# Altium schematic sheet régulateur.SchDoc
size A4; SheetNumber: 3; SheetTotal: 4
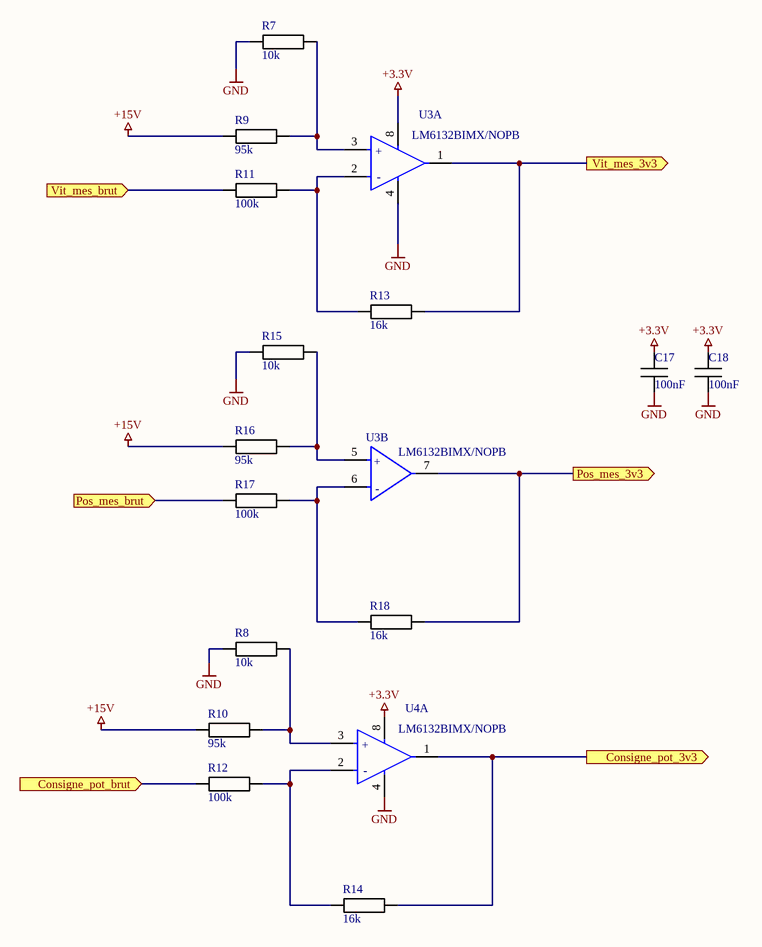
[diagram p0: régulateur.SchDoc]

## Parts
C17  100nF  [CAPC1608X08M]
C18  100nF  [CAPC1608X08M]
R7  10k  [RESC2012X06M]
R8  10k  [RESC2012X06M]
R9  95k  [RESC2012X06M]
R10  95k  [RESC2012X06M]
R11  100k  [RESC2012X06M]
R12  100k  [RESC2012X06M]
R13  16k  [RESC2012X06M]
R14  16k  [RESC2012X06M]
R15  10k  [RESC2012X06M]
R16  95k  [RESC2012X06M]
R17  100k  [RESC2012X06M]
R18  16k  [RESC2012X06M]
U3  LM6132BIMX/NOPB  [FP-LM6132BIMX-NOPB-MFG]  (parts A,B of 2)
U4  LM6132BIMX/NOPB  [FP-LM6132BIMX-NOPB-MFG]  (part A of 2)

## Ports
Consigne_pot_3v3 (out), Consigne_pot_brut (in), Pos_mes_3v3 (out), Pos_mes_brut (in), Vit_mes_3v3 (out), Vit_mes_brut (in)

## Nets
+3.3V: C17.2 C18.2 U3.8(V+) U4.8(V+)
+15V: R9.1 R10.1 R16.1
GND: C17.1 C18.1 R7.1 R8.1 R15.1 U3.4(V-) U4.4(V-)
Consigne_pot_3v3: R14.1 U4.1(OUT_A) ; port Consigne_pot_3v3
Consigne_pot_brut: R12.1 ; port Consigne_pot_brut
Pos_mes_3v3: R18.1 U3.7(OUT_B) ; port Pos_mes_3v3
Pos_mes_brut: R17.1 ; port Pos_mes_brut
Vit_mes_3v3: R13.1 U3.1(OUT_A) ; port Vit_mes_3v3
Vit_mes_brut: R11.1 ; port Vit_mes_brut
NetR7_2: R7.2 R9.2 U3.3(+IN_A)
NetR8_2: R8.2 R10.2 U4.3(+IN_A)
NetR11_2: R11.2 R13.2 U3.2(-IN_A)
NetR12_2: R12.2 R14.2 U4.2(-IN_A)
NetR15_2: R15.2 R16.2 U3.5(+IN_B)
NetR17_2: R17.2 R18.2 U3.6(-IN_B)

## Notes on the sheet
- (in symbol CMP-04895-000003-1, part A) +; -
- (in symbol CMP-04895-000003-1, part B) +; -

## Library data of the parts
C17 C18 = CMP-065-000000-2: CAPC 100nF X7R 50V 10% 1608 (0603 INCH); Manufacturer: TDK; Manufacturer Number: CGA3E2X7R1H104K080AA; IsStocked: 1; PN: PN-338083; Current: NULL; TemperatureRange: -55°C to +125°C; Voltage: 50V; Dielectric: X7R; Value: 100nF; Category: Passives; Supplier Price 1: 0.0100; Supplier Part Number 1: FAB.0603_C 100n; SubCategory: Condensateurs ceramique; Tolerance: ±10%; Supplier 1: ETML; TemperatureCoeff: NULL; Power: NULL
R7-R18 = CMP-066-000209-2: RES 68kohm  ±1% 0.125W 2012 (0805 INCH); Manufacturer Number: RC0805FR-0768KL; Manufacturer: Yageo; TemperatureRange: -55°C to 155°C; PN: PN-665325; Value: 68k; TemperatureCoeff: ±200ppm/°C; Voltage: 150V; IsStocked: 1; Supplier Part Number 1: FAB.0805_R 68k; Category: Passives; Supplier 1: ETML; SubCategory: Resistances couche epaisse; Power: 0.125W; Supplier Price 1: 0.0200; Tolerance: ±1%
U3 U4 = CMP-04895-000003-1: IC OPAMP GP 2 CIRCUIT 8SOIC; Manufacturer: Texas Instruments; Nominal Supply Current: 720uA; Number Of Channels: 2; Voltage Gain: 102V/mV; Input Offset Voltage: 1.7V; Max Dual Supply Voltage: 12V; Gain Bandwidth: 11MHz; Min Supply Voltage: 1.8V; Max Junction Temp: +150°C; Standoff Height: 0.11mm; Output Current Per Channel: 3.5mA; Min Dual Supply Voltage: 0.9V; Max Supply Voltage: 24V; Input Bias Current: 0.125uA; Digikey Description: IC OPAMP GP 2 CIRCUIT 8SOIC; Height: 1.75mm; ComponentLink2URL: http://www.ti.com/lit/ds/symlink/lm6132.pdf; Temperature Range High: +85°C; Device Class L2: Linear ICs; Manufacturer Part Number: LM6132BIMX/NOPB; Lead Free: Yes; ComponentLink2Description: Datasheet; Temperature: -40°C to +85°C; Device Class L1: Integrated Circuits (ICs); Category: IC; Temperature Range Low: -40°C; Automotive: No; RoHS: TRUE; Package: SOIC-8; Octopart: https://octopart.com/lm6132bimx%2Fnopb-texas+instruments-24814947; Mouser Description: Operational Amplifiers - Op Amps DUAL LOW POWER 10 MHZ RRIO OP AMP; Device Class L3: Amplifiers - Op Amps